# EAGLE design Arduino-TPUART (EAGLE 7.4.0)
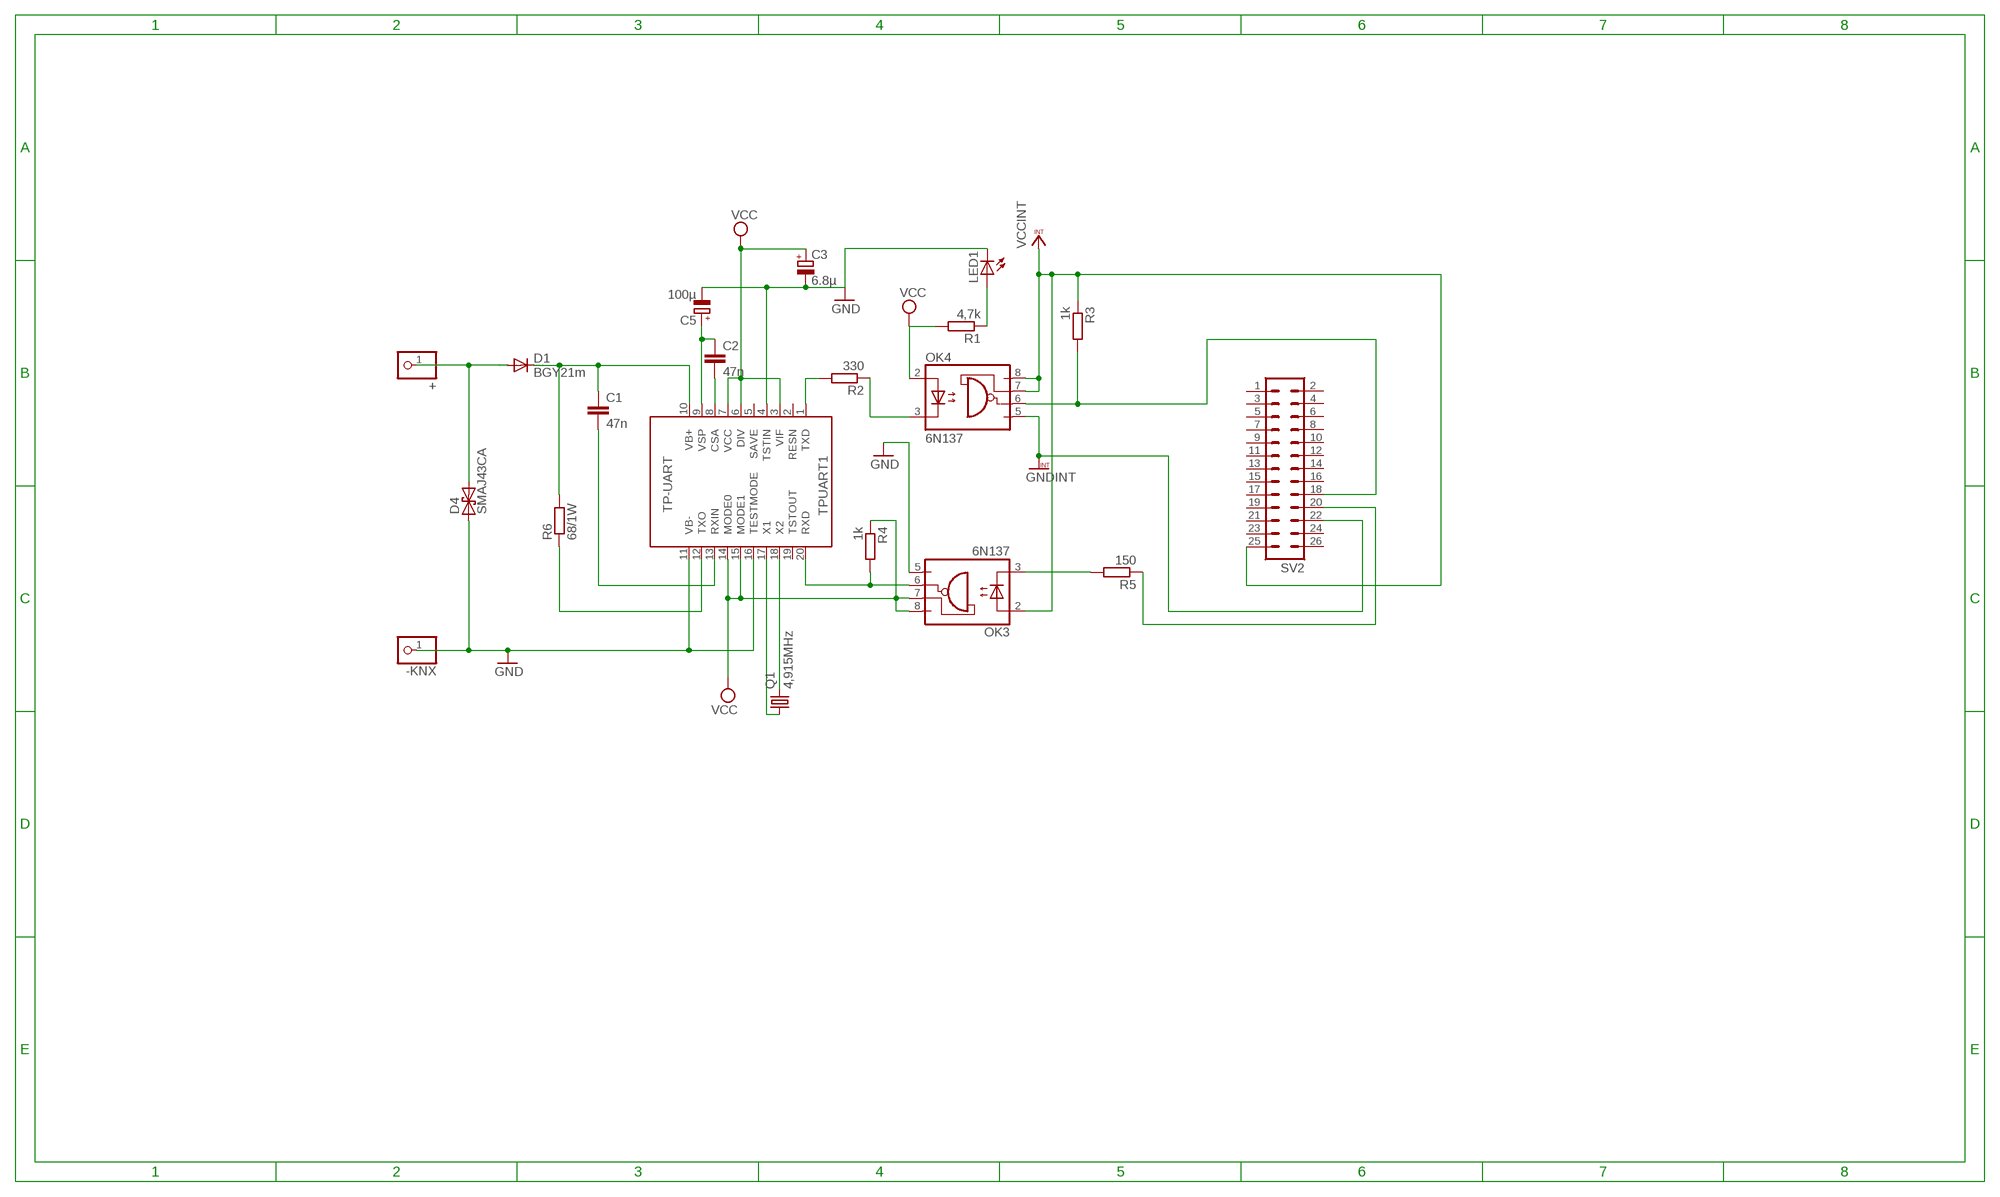
[diagram p0: schematic, sheet 1]

## Parts
+  PINHD-1X1  [1X01]
-KNX  PINHD-1X1  [1X01]
C1  47n  C-EUC1206  [C1206]
C2  47n  C-EUC1206  [C1206]
C3  6.8µ  CPOL-EUCT7343  [CT7343]
C5  100µ  CPOL-EUCT7343  [CT7343]
D1  BGY21m  ES2D  [SMB]
D4  SMAJ43CA  BZW04XXB  [DO214AA]
LED1  LEDKA-3528ASYC  [KA-3528ASYC]
OK3  6N137  [DIL8-SMD]
OK4  6N137  [DIL8-SMD]
Q1  4,915MHz  CRYSTALHC49UP  [HC49UP]
R1  4,7k  R-EU_M1206  [M1206]
R2  330  R-EU_M1206  [M1206]
R3  1k  R-EU_M1206  [M1206]
R4  1k  R-EU_M1206  [M1206]
R5  150  R-EU_M1206  [M1206]
R6  68/1W  R-EU_R2512  [R2512]
SV2  MA13-2  [MA13-2]
TPUART1  TP-UART  [SOIC20]

## Nets
ARDUINO_RXD: OK4.6(VO) R3.2 SV2.18
GND [supply]: -KNX.1 C3.- C5.- D4.A LED1.C OK3.5(GND) TPUART1.4(TSTIN) TPUART1.11(VB-) TPUART1.16(TESTMODE)
GNDINT [supply]: OK4.5(GND) SV2.22
KNX+ [supply]: +.1 D1.A D4.C
N$1 [supply]: C1.1 D1.C R6.2 TPUART1.10(VB+)
N$3: R6.1 TPUART1.12(TXO)
N$4: C1.2 TPUART1.13(RXIN)
N$5: C2.2 TPUART1.8(CSA)
N$6: C2.1 C5.+ TPUART1.9(VSP)
N$7: Q1.1 TPUART1.17(X1)
N$8: Q1.2 TPUART1.18(X2)
N$9: R2.2 TPUART1.1(TXD)
N$10: OK4.3(C) R2.1
N$11: R5.1 SV2.20
N$12: OK3.6(VO) R4.2 TPUART1.20(RXD)
N$14: OK3.3(C) R5.2
N$18: LED1.A R1.1
VCC [supply]: C3.+ OK3.7(VE) OK3.8(VCC) OK4.2(A) R1.2 R4.1 TPUART1.3(VIF) TPUART1.6(DIV) TPUART1.7(VCC) TPUART1.14(MODE0) TPUART1.15(MODE1)
VCCINT [supply]: OK3.2(A) OK4.7(VE) OK4.8(VCC) R3.1 SV2.25
Unconnected: SV2.1 SV2.2 SV2.3 SV2.4 SV2.5 SV2.6 SV2.7 SV2.8 SV2.9 SV2.10 SV2.11 SV2.12 SV2.13 SV2.14 SV2.15 SV2.16 SV2.17 SV2.19 SV2.21 SV2.23 SV2.24 SV2.26 TPUART1.2(RESN) TPUART1.5(SAVE) TPUART1.19(TSTOUT)

## Library data of the parts
+ -KNX = pinhead:PINHD-1X1: PIN HEADER
C1 C2 = resistor:C-EU: CAPACITOR, European symbol
C3 C5 = resistor:CPOL-EU: POLARIZED CAPACITOR, European symbol
D1 = diode:ES2D: DIODE super fast rectifier, 2 A
D4 = diode:BZW04XXB: DIODE uni and bidirectional supressor diode
LED1 = led:LED: LED OSRAM: - CHIPLED LG R971, LG N971, LY N971, LG Q971, LY Q971, LO R971, LY R971 LH N974, LH R974 LS Q976, LO Q976, LY Q976 LO Q996 - Hyper CHIPLED LW Q18S LB Q993, LB Q99A, LB R99A - SideLED LS A670, LO A670, LY A670, LG A670, LP A670 LB A673, LV A673, LT A673, LW A673 LH A674 LY A675 LS A676, LA A676, LO A676, LY A676, LW A676 LS A679, LY A679, LG A679 - Hyper Micro SIDELED® LS Y876, LA Y876, LO Y876, LY Y876 LT Y87S - SmartLED LW L88C, LW L88S LB L89C, LB L89S, LG L890 LS L89K, LO L89K, LY L89K LS L896, LA L896, LO L896, LY L896 - TOPLED LS T670, LO T670, LY T670, LG T670, LP T670 LSG T670, LSP T670, LSY T670, LOP T670, LYG T670 LG T671, LOG T671, LSG T671 LB T673, LV T673, LT T673, LW T673 LH T674 LS T676, LA T676, LO T676, LY T676, LB T676, LH T676, LSB T676, LW T676 LB T67C, LV T67C, LT T67C, LS T67K, LO T67K, LY T67K, LW E67C LS E67B, LA E67B, LO E67B, LY E67B, LB E67C, LV E67C, LT E67C LW T67C LS T679, LY T679, LG T679 LS T770, LO T770, LY T770, LG T770, LP T770 LB T773, LV T773, LT T773, LW T773 LH T774 LS E675, LA E675, LY E675, LS T675 LS T776, LA T776, LO T776, LY T776, LB T776 LHGB T686 LT T68C, LB T68C - Hyper Mini TOPLED® LB M676 - Mini TOPLED Santana® LG M470 LS M47K, LO M47K, LY M47K Source: http://www.osram.convergy.de LUXEON: - LUMILED® LXK2-PW12-R00, LXK2-PW12-S00, LXK2-PW14-U00, LXK2-PW14-V00 LXK2-PM12-R00, LXK2-PM12-S00, LXK2-PM14-U00 LXK2-PE12-Q00, LXK2-PE12-R00, LXK2-PE12-S00, LXK2-PE14-T00, LXK2-PE14-U00 LXK2-PB12-K00, LXK2-PB12-L00, LXK2-PB12-M00, LXK2-PB14-N00, LXK2-PB14-P00, LXK2-PB14-Q00 LXK2-PR12-L00, LXK2-PR12-M00, LXK2-PR14-Q00, LXK2-PR14-R00 LXK2-PD12-Q00, LXK2-PD12-R00, LXK2-PD12-S00 LXK2-PH12-R00, LXK2-PH12-S00 LXK2-PL12-P00, LXK2-PL12-Q00, LXK2-PL12-R00 Source: www.luxeon.com KINGBRIGHT: KA-3528ASYC Source: www.kingbright.com
OK3 OK4 = optocoupler:6N137: MOTOROLA OPTO COUPLER
Q1 = crystal:CRYSTAL: CRYSTAL; OC_FARNELL: unknown; OC_NEWARK: unknown
R1-R6 = resistor:R-EU_: RESISTOR, European symbol
SV2 = con-lstb:MA13-2: PIN HEADER; OC_FARNELL: unknown; OC_NEWARK: unknown
TPUART1 = tpuart-actiface:TP-UART: Siemens TP-UART

## Net classes
0 default: width 0.3 mm
1 supply: width 0.6 mm

## Board
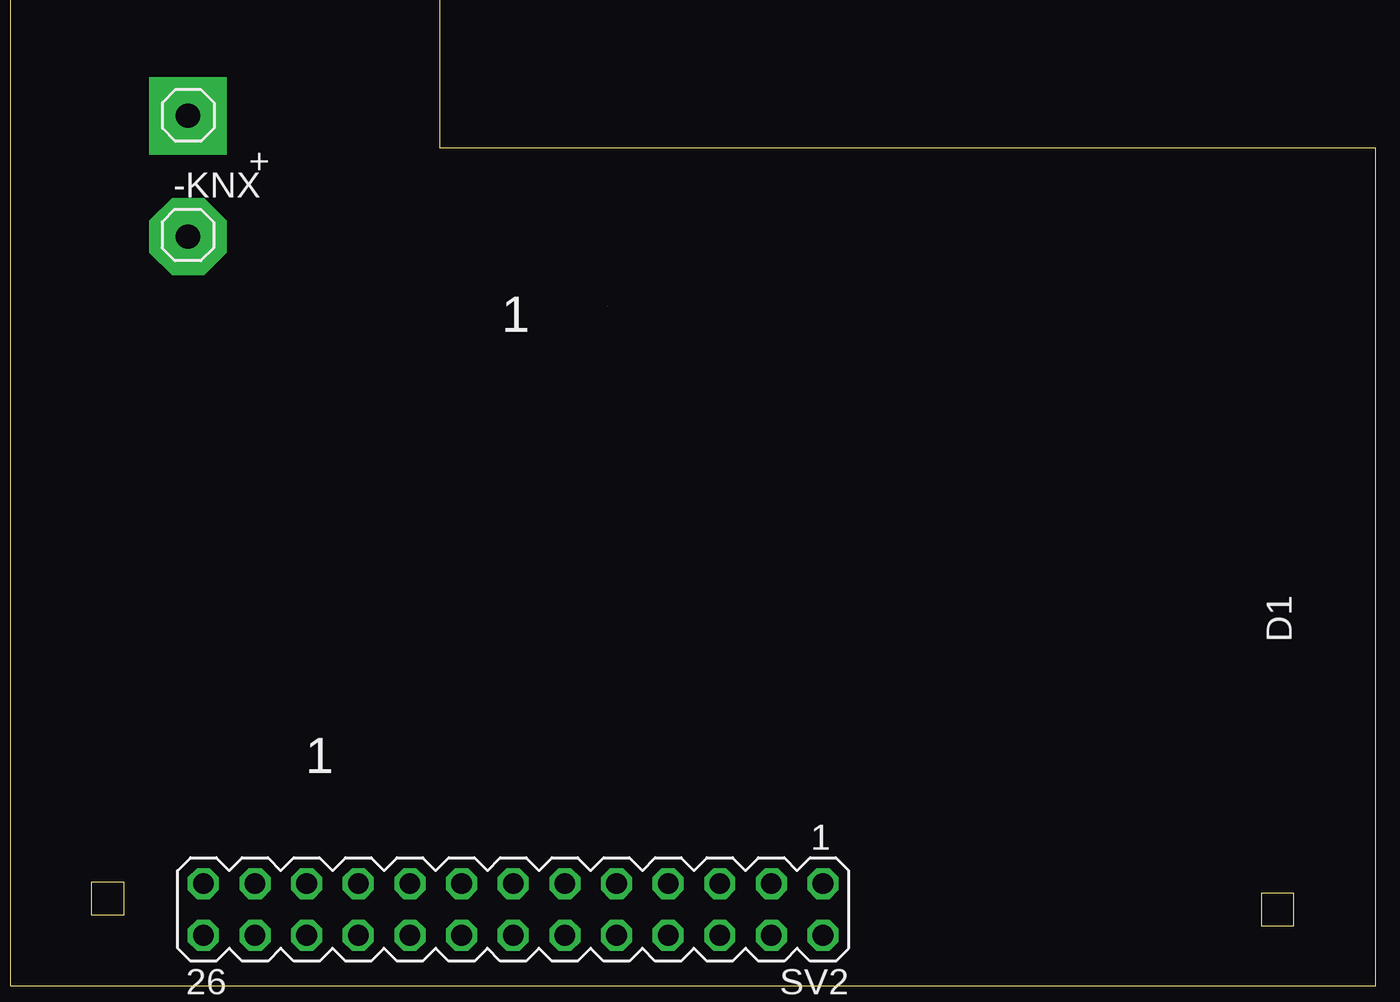
[diagram p1: board, top side]
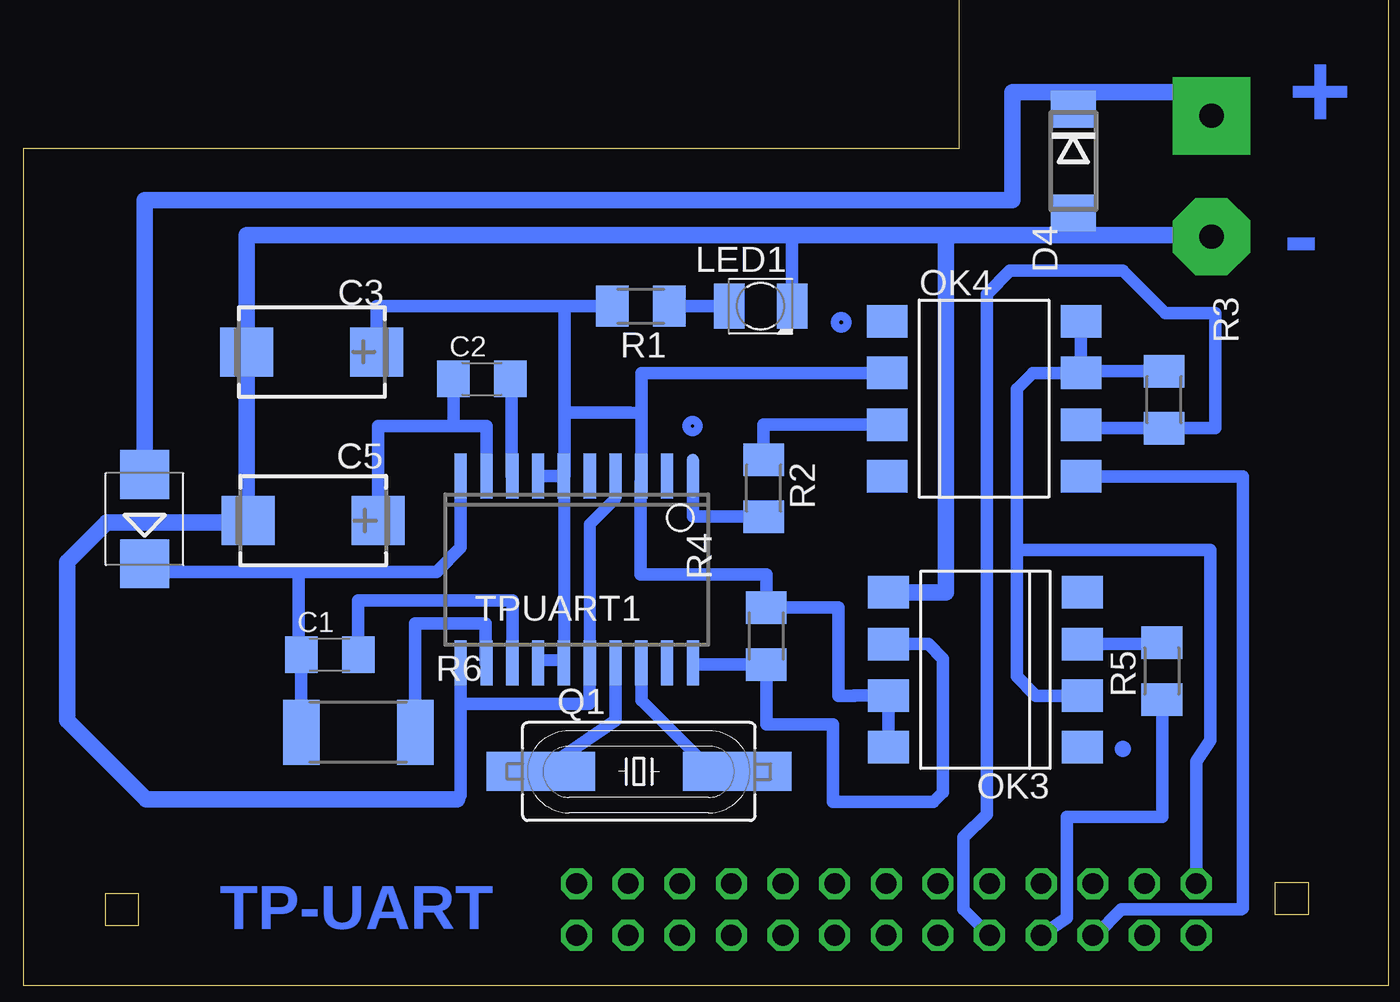
[diagram p2: board, bottom side, seen from below]

No outline drawn. Coordinates in mm, seen from the top.
Copper layers (1*16): Top 0.035mm / dielectric 1.5mm / Bottom 0.035mm
Design rules "default": minimum track width 10mil, minimum drill 24mil, track to track 8mil, track to pad 8mil, pad to pad 8mil, via to via 8mil, smd to smd 8mil, copper to edge 40mil, drill to drill 8mil, minimum pad ring 10mil, minimum via ring 8mil, stop-mask expansion 4mil, vias tented up to drill 0mil, thermal gap 10mil
Milling: 18 lines

### Footprints (pad centres in the part's own frame; a part is rotated, then mirrored left to right if it is on the bottom)
1X01 = drill 1.016 octagon: 1 0,0
C1206 = smd 1.6 x 1.8: 1 -1.4,0; 2 1.4,0
CT7343 = smd 2.6 x 2.4: + 3.2,0; - -3.2,0
SMB = smd 2.4 x 2.4: A 2.2,0; C -2.2,0
DO214AA = smd 1.8 x 2.2: A 2.55,0; C -2.55,0
KA-3528ASYC = smd 1.5 x 2.2: A -1.55,0; C 1.55,0
DIL8-SMD = smd 1.6 x 2: 1 -3.81,-4.77; 2 -1.27,-4.77; 3 1.27,-4.77; 4 3.81,-4.77; 5 3.81,4.77; 6 1.27,4.77; 7 -1.27,4.77; 8 -3.81,4.77
HC49UP = smd 5.334 x 1.93: 1 -4.826,0; 2 4.826,0
M1206 = smd 1.6 x 2: 1 -1.4,0; 2 1.4,0
R2512 = smd 1.8 x 3.2: 1 -2.8,0; 2 2.8,0
MA13-2 = drill 1.016 octagon: 1 -15.24,-1.27; 2 -15.24,1.27; 3 -12.7,-1.27; 4 -12.7,1.27; 5 -10.16,-1.27; 6 -10.16,1.27; 7 -7.62,-1.27; 8 -7.62,1.27; 9 -5.08,-1.27; 10 -5.08,1.27; 11 -2.54,-1.27; 12 -2.54,1.27; 13 0,-1.27; 14 0,1.27; 15 2.54,-1.27; 16 2.54,1.27; 17 5.08,-1.27; 18 5.08,1.27; 19 7.62,-1.27; 20 7.62,1.27; 21 10.16,-1.27; 22 10.16,1.27; 23 12.7,-1.27; 24 12.7,1.27; 25 15.24,-1.27; 26 15.24,1.27
SOIC20 = smd 0.6 x 2.2: 1 -5.715,-4.6; 2 -4.445,-4.6; 3 -3.175,-4.6; 4 -1.905,-4.6; 5 -0.635,-4.6; 6 0.635,-4.6; 7 1.905,-4.6; 8 3.175,-4.6; 9 4.445,-4.6; 10 5.715,-4.6; 11 5.715,4.6; 12 4.445,4.6; 13 3.175,4.6; 14 1.905,4.6; 15 0.635,4.6; 16 -0.635,4.6; 17 -1.905,4.6; 18 -3.175,4.6; 19 -4.445,4.6; 20 -5.715,4.6

### Placement (x,y rotation side)
+  9.06,42.68 270 top
-KNX  9.04,36.8 0 top
C1  52.42,16.16 0 bottom
C2  44.94,29.72 0 bottom
C3  53.31,31.05 0 bottom
C5  53.24,22.75 0 bottom
D1  61.52,22.82 90 bottom
D4  15.84,40.44 270 bottom
LED1  31.22,33.3 0 bottom
OK3  20.17,15.41 90 bottom
OK4  20.23,28.74 270 bottom
Q1  37.21,10.41 0 bottom
R1  37.12,33.3 180 bottom
R2  31.07,24.34 270 bottom
R3  11.38,28.7 270 bottom
R4  30.94,17.07 270 bottom
R5  11.49,15.35 90 bottom
R6  51.01,12.33 180 bottom
SV2  25.04,3.62 180 top
TPUART1  40.27,20.34 180 bottom

### Tracks (layer width: path | path; a pad name or v marks a point on that pad's centre or on a via)
ARDUINO_RXD
  Bottom 0.406: 15.29,27.3 OK4.6
  Bottom 0.61: SV2.18 21.24,3.62 21.24,7.17 20.1,8.31 20.1,33.9 18.96,35.04 13.4,35.04 11.32,32.96 8.84,32.96 8.84,27.3 R3.2 15.46,27.3 OK4.6 15.46,27.85
GND  (1 unrouted)
  Bottom 0.406: 56.51,22.87 C5.- 55.66,22.65 | 39.63,13.77 39.66,13.73 | 45.83,13.73 45.96,13.6 45.96,15.73 TPUART1.11 | 45.98,9.23 46.16,9.04
  Bottom 0.6: TPUART1.16 39.63,22.57 38.36,23.84 TPUART1.4
  Bottom 0.61: TPUART1.16 39.63,13.77 | 39.66,13.73 45.83,13.73 | TPUART1.11 45.98,9.23 | 14.9,36.8 D4.A | 29.88,33.3 29.68,33.3 | 29.68,36.8 29.67,36.8 LED1.C
  Bottom 0.813: 56.51,22.87 C3.- 56.51,36.8 29.68,36.8 22.11,36.8 | 46.16,9.04 61.44,9.04 65.33,12.93 65.33,20.7 63.38,22.65 55.66,22.65 | 22.11,36.8 14.9,36.8 -KNX.1 | OK3.5 22.11,19.22 22.11,36.8
GNDINT
  Bottom 0.406: SV2.22 14.73,2.35 | 7.57,3.62 7.5,3.69 | OK4.5
  Bottom 0.61: 14.73,2.35 13.47,3.62 7.57,3.62 | 7.5,3.69 7.5,24.92 OK4.5
KNX+
  Bottom 0.406: D4.C 14.9,43.79 14.87,43.81
  Bottom 0.61: 9.06,43.81 +.1
  Bottom 0.813: 9.06,43.81 14.87,43.81 18.83,43.81 18.83,38.52 61.52,38.52 D1.A
N$1
  Bottom 0.61: TPUART1.10 45.98,21.42 47.17,20.23 53.94,20.23 | 53.94,20.23 61.13,20.23 arc90 D1.C | R6.2 C1.1 53.94,16.16 53.94,20.23
N$3
  Bottom 0.61: R6.1 48.21,17.69 44.76,17.69 44.76,15.74 TPUART1.12
N$4
  Bottom 0.61: TPUART1.13 43.42,15.74 43.42,18.83 51.02,18.83 C1.2
N$5
  Bottom 0.61: TPUART1.8 43.47,24.95 43.47,29.72 C2.2
N$6
  Bottom 0.61: TPUART1.9 44.71,27.4 46.34,27.4 | 46.34,27.4 C2.1 | C5.+ 50.04,27.4 46.34,27.4
N$7
  Bottom 0.61: TPUART1.17 38.36,12.92 Q1.1
N$8
  Bottom 0.406: 33.77,10.59 32.69,10.59 Q1.2
  Bottom 0.61: TPUART1.18 37.09,13.91 33.77,10.59
N$9
  Bottom 0.61: TPUART1.1 34.55,22.94 R2.2
N$10
  Bottom 0.61: OK4.3 31.07,27.47 R2.1
N$11
  Bottom 0.406: 11.46,13.91 R5.1
  Bottom 0.61: SV2.20 16.15,3.22 16.15,8.17 11.46,8.17 11.46,13.91
N$12
  Bottom 0.3: 34.55,15.58 TPUART1.20
  Bottom 0.305: 34.57,15.73 TPUART1.20
  Bottom 0.406: 34.53,15.73 TPUART1.20 34.47,15.67
  Bottom 0.61: OK3.6 22.98,16.68 22.24,15.95 22.24,9.38 22.71,8.91 27.67,8.91 27.67,12.73 30.94,12.73 R4.2 34.55,15.67 TPUART1.20 34.55,16.22
N$14
  Bottom 0.406: R5.2 11.66,16.75 11.72,16.68 | OK3.3
  Bottom 0.61: 11.72,16.68 OK3.3
N$16  (via drill 1.2 pad 3.81)
  other vias: 9.05,42.67
N$17  (via drill 1.2 pad 3.81)
  other vias: 9.04,36.72
N$18
  Bottom 0.61: R1.1 LED1.A
VCC
  Bottom 0.406: 40.87,24.98 TPUART1.6 | 37.12,24.65 TPUART1.3
  Bottom 0.6: 40.9,15.9 42.17,15.9 TPUART1.14 | TPUART1.6 40.9,15.9 | 40.9,15.9 TPUART1.15
  Bottom 0.61: TPUART1.6 TPUART1.7 | TPUART1.3 37.09,28.05 | 37.09,28.05 37.65,28.07 40.87,28.07 | 40.87,24.98 40.87,28.07 | 40.87,28.07 40.87,33.3 | 37.12,24.65 37.12,20.1 30.94,20.1 R4.1 27.4,18.47 27.4,14.14 26.61,14.14 OK3.7 OK3.8 | OK4.2 37.09,30.01 37.09,28.05 | 40.87,33.3 50.11,33.3 C3.+ | R1.2 40.87,33.3
VCCINT
  Bottom 0.406: 15.38,30.1 OK4.7 | OK3.2 | 18.56,21.31 18.63,21.24
  Bottom 0.61: OK4.7 OK4.8 | OK4.7 17.82,30.01 18.63,29.21 18.63,21.24 18.63,15.07 17.69,14.14 OK3.2 | SV2.25 9.8,10.9 9.11,11.93 9.11,21.31 18.56,21.31 | 15.46,29.55 OK4.7 | R3.1 15.46,30.1 OK4.7
(copper drawn outside any net)
  shapes: Bottom circle x3

### Text on the board
Bottom: + | - | TP-UART
tNames: 1 | 1